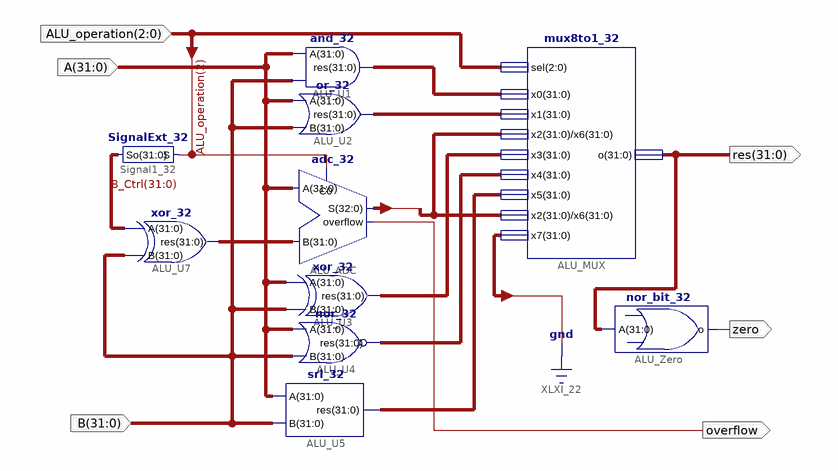
[diagram p0: schematic sheet 1]
// Xilinx ISE schematic ALU.sch (spartan6) as structural Verilog: 10 symbols, 6 ports
module ALU (
  input  [2:0] ALU_operation,
  input  [31:0] A,
  input  [31:0] B,
  output [31:0] res,
  output zero,
  output overflow
);

  wire [31:0] B_Ctrl, XLXN_8, XLXN_12, XLXN_13, XLXN_17, XLXN_18, XLXN_19;
  wire [32:0] S;

  SignalExt_32 Signal1_32 (.So(B_Ctrl), .S(ALU_operation[2]));
  xor_32 ALU_U7 (.A(B_Ctrl), .B(B), .res(XLXN_8));
  and_32 ALU_U1 (.res(XLXN_12), .A(A), .B(B));
  or_32 ALU_U2 (.res(XLXN_13), .A(A), .B(B));
  adc_32 ALU_ADC (.B(XLXN_8), .A(A), .C0(ALU_operation[2]), .overflow(overflow), .S(S));
  xor_32 ALU_U3 (.A(A), .B(B), .res(XLXN_17));
  nor_32 ALU_U4 (.res(XLXN_18), .A(A), .B(B));
  srl_32 ALU_U5 (.A(A), .B(B), .res(XLXN_19));
  mux8to1_32 ALU_MUX (
    .x1(XLXN_13), .sel(ALU_operation), .o(res), .x0(XLXN_12), .x2(S[31:0]), .x3(XLXN_17), .x4(XLXN_18),
    .x5(XLXN_19), .x6(S[31:0]), .x7({{31{1'b0}}, S[32]}));
  nor_bit_32 ALU_Zero (.o(zero), .A(res));
endmodule
